# Altium schematic sheet Active Indicator.SchDoc
size A4
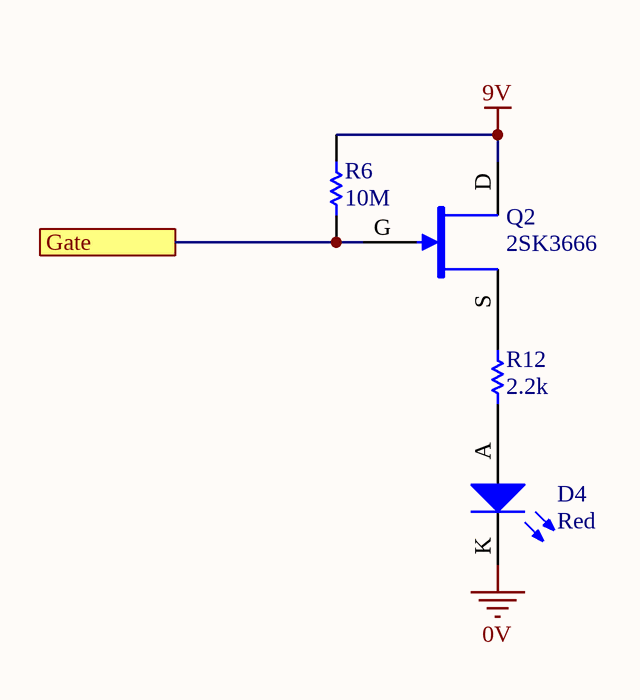
[diagram p0: Active Indicator.SchDoc]

## Parts
D4  Red  [0805 LED]
Q2  2SK3666  [ON SOT-23 JFET]
R6  10M  [0805]
R12  2.2k  [0805]

## Ports
Gate

## Nets
0V: D4.K
9V: Q2.D R6.2
Gate: Q2.G R6.1 ; port Gate
NetD4_A: D4.A R12.1
NetQ2_S: Q2.S R12.2

## Library data of the parts
D4 = SML-210LTT86: Red LED Indication - Discrete 1.75V 0805 (2012 Metric); Manufacturer: ROHM Semiconductor; Part Number: SML-210LTT86; Colour: Red; Digikey Part Number: 511-1286-1-ND; Digikey Link: https://www.digikey.com/product-detail/en/rohm-semiconductor/SML-210LTT86/511-1286-1-ND/637099
Q2 = 2SK3666: JFET N-Channel 10mA 200mW Surface Mount 3-CP; Manufacturer: ON Semiconductor; Published: 24-Mar-1999; LatestRevisionDate: 29-May-2009; LatestRevisionNote: IPC-7351 Footprint Added.; PackageVersion: Sep-2000; PackageReference: SOT-343; Publisher: Altium Limited; PackageDescription: 4-Pin SOT-343 Package 1.3 mm Pitch, 2.1 mm Lead Span; Part Number: 2SK3666; Digikey Part Number: 869-1107-1-ND; Digikey Link: https://www.digikey.com/product-detail/en/on-semiconductor/2SK3666-3-TB-E/869-1107-1-ND/2165585
R6 = RC0805FR0710ML: Manufacturer: YAGEO; Tolerance: 0.01; Rated Voltage: 0.125W; Part Number: RC0805FR0710ML; Value: 10M; Material: FR-07; Digikey Part Number: 311-10.0MCRCT-ND
R12 = RC0805FR072K2L: Manufacturer: YAGEO; Tolerance: 0.01; Rated Voltage: 0.125W; Part Number: RC0805FR072K2L; Value: 2.2k; Material: FR-07; Digikey Part Number: 311-2.20KCRCT-ND